# EAGLE design BMS MiniCAN Themistor Board Rev. 4 (EAGLE 7.7.0)
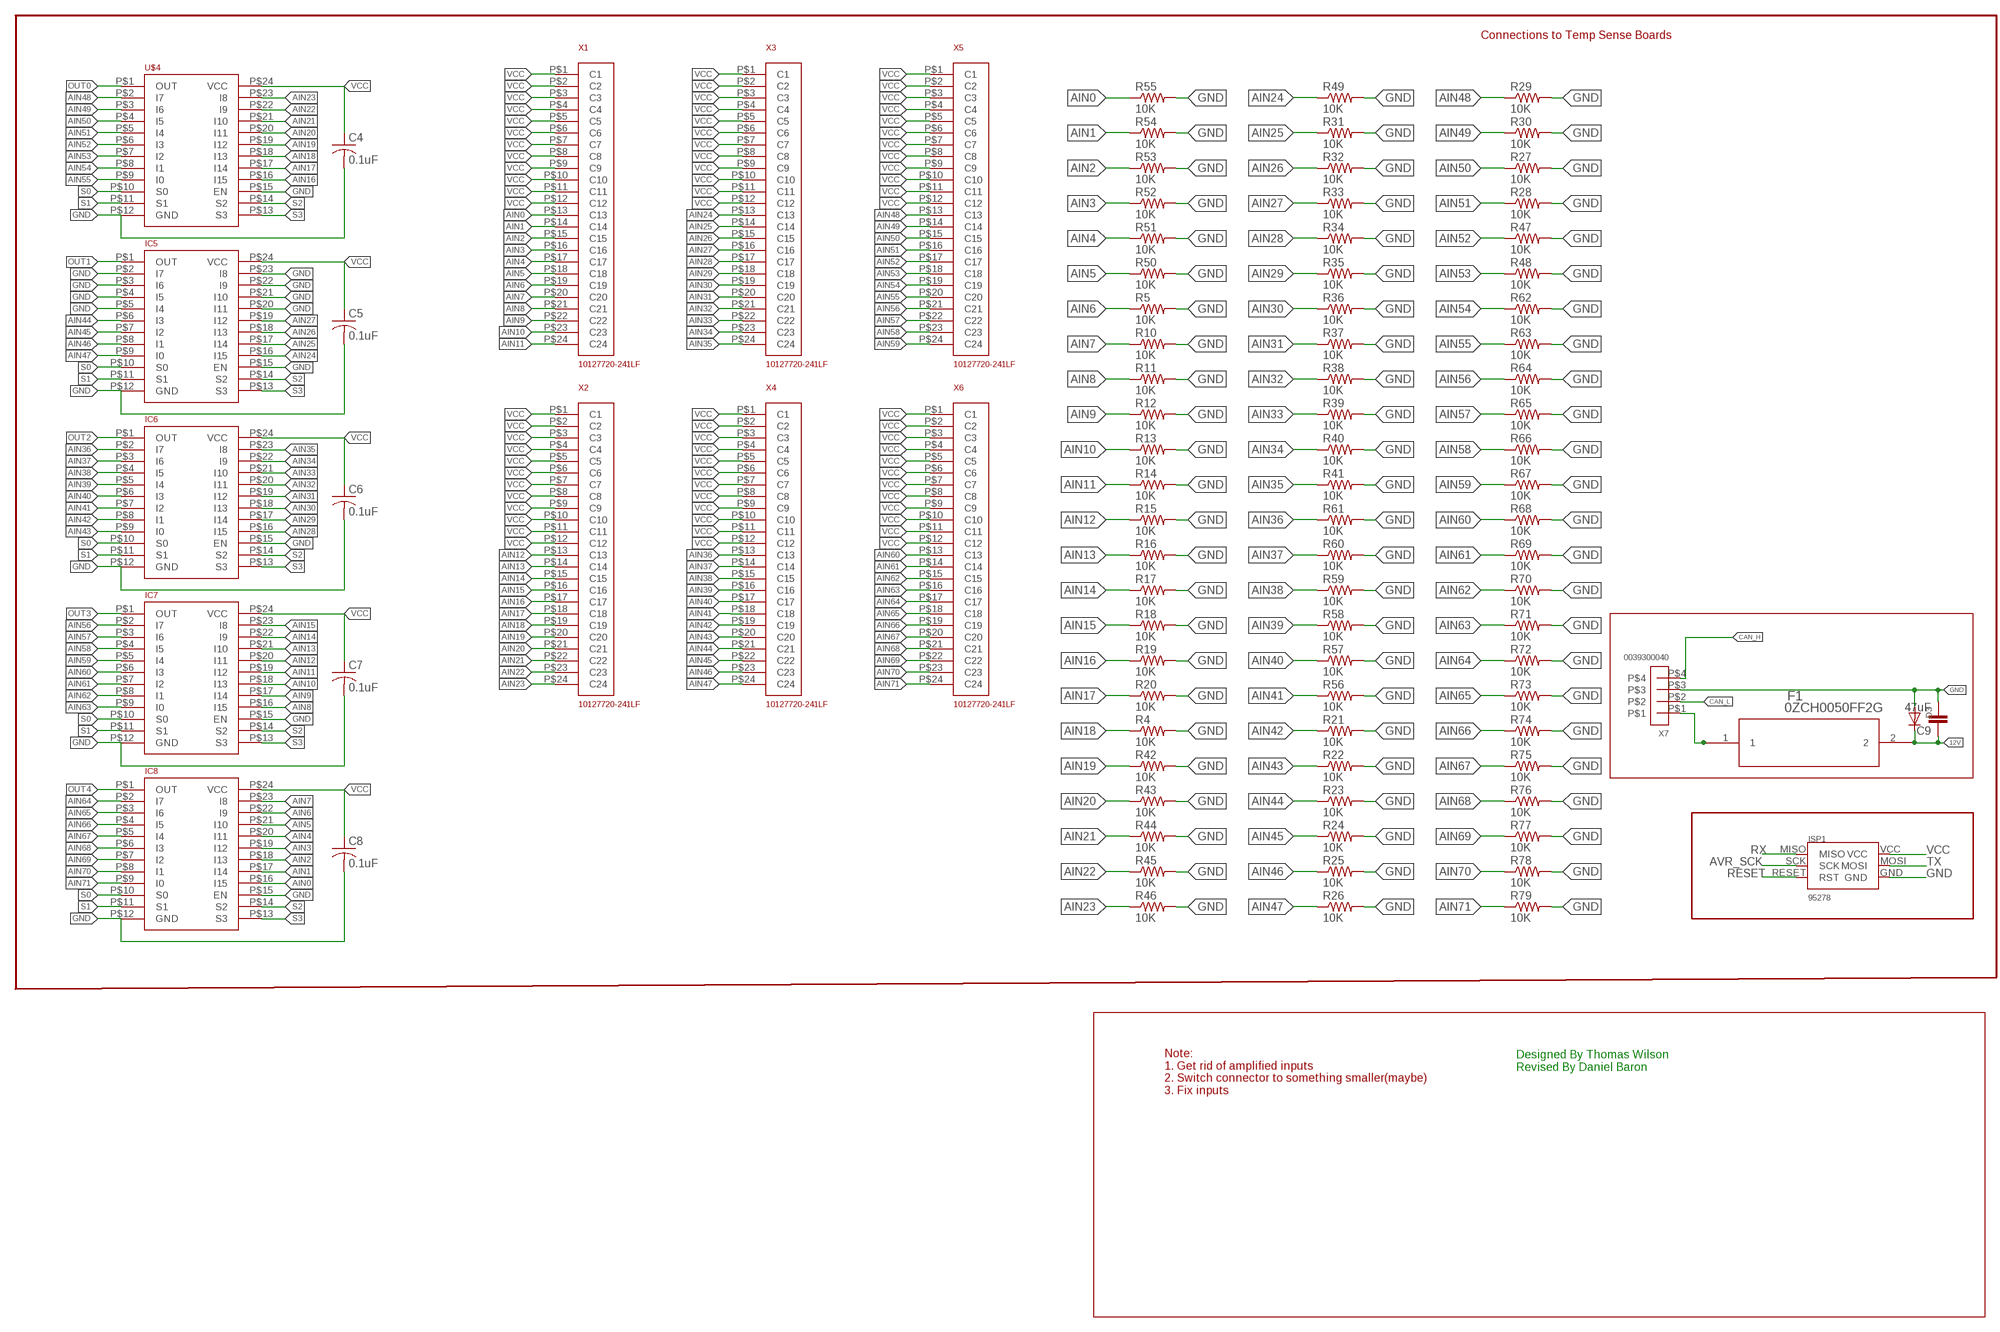
[diagram p0: schematic, sheet 1, part 1 of 2]
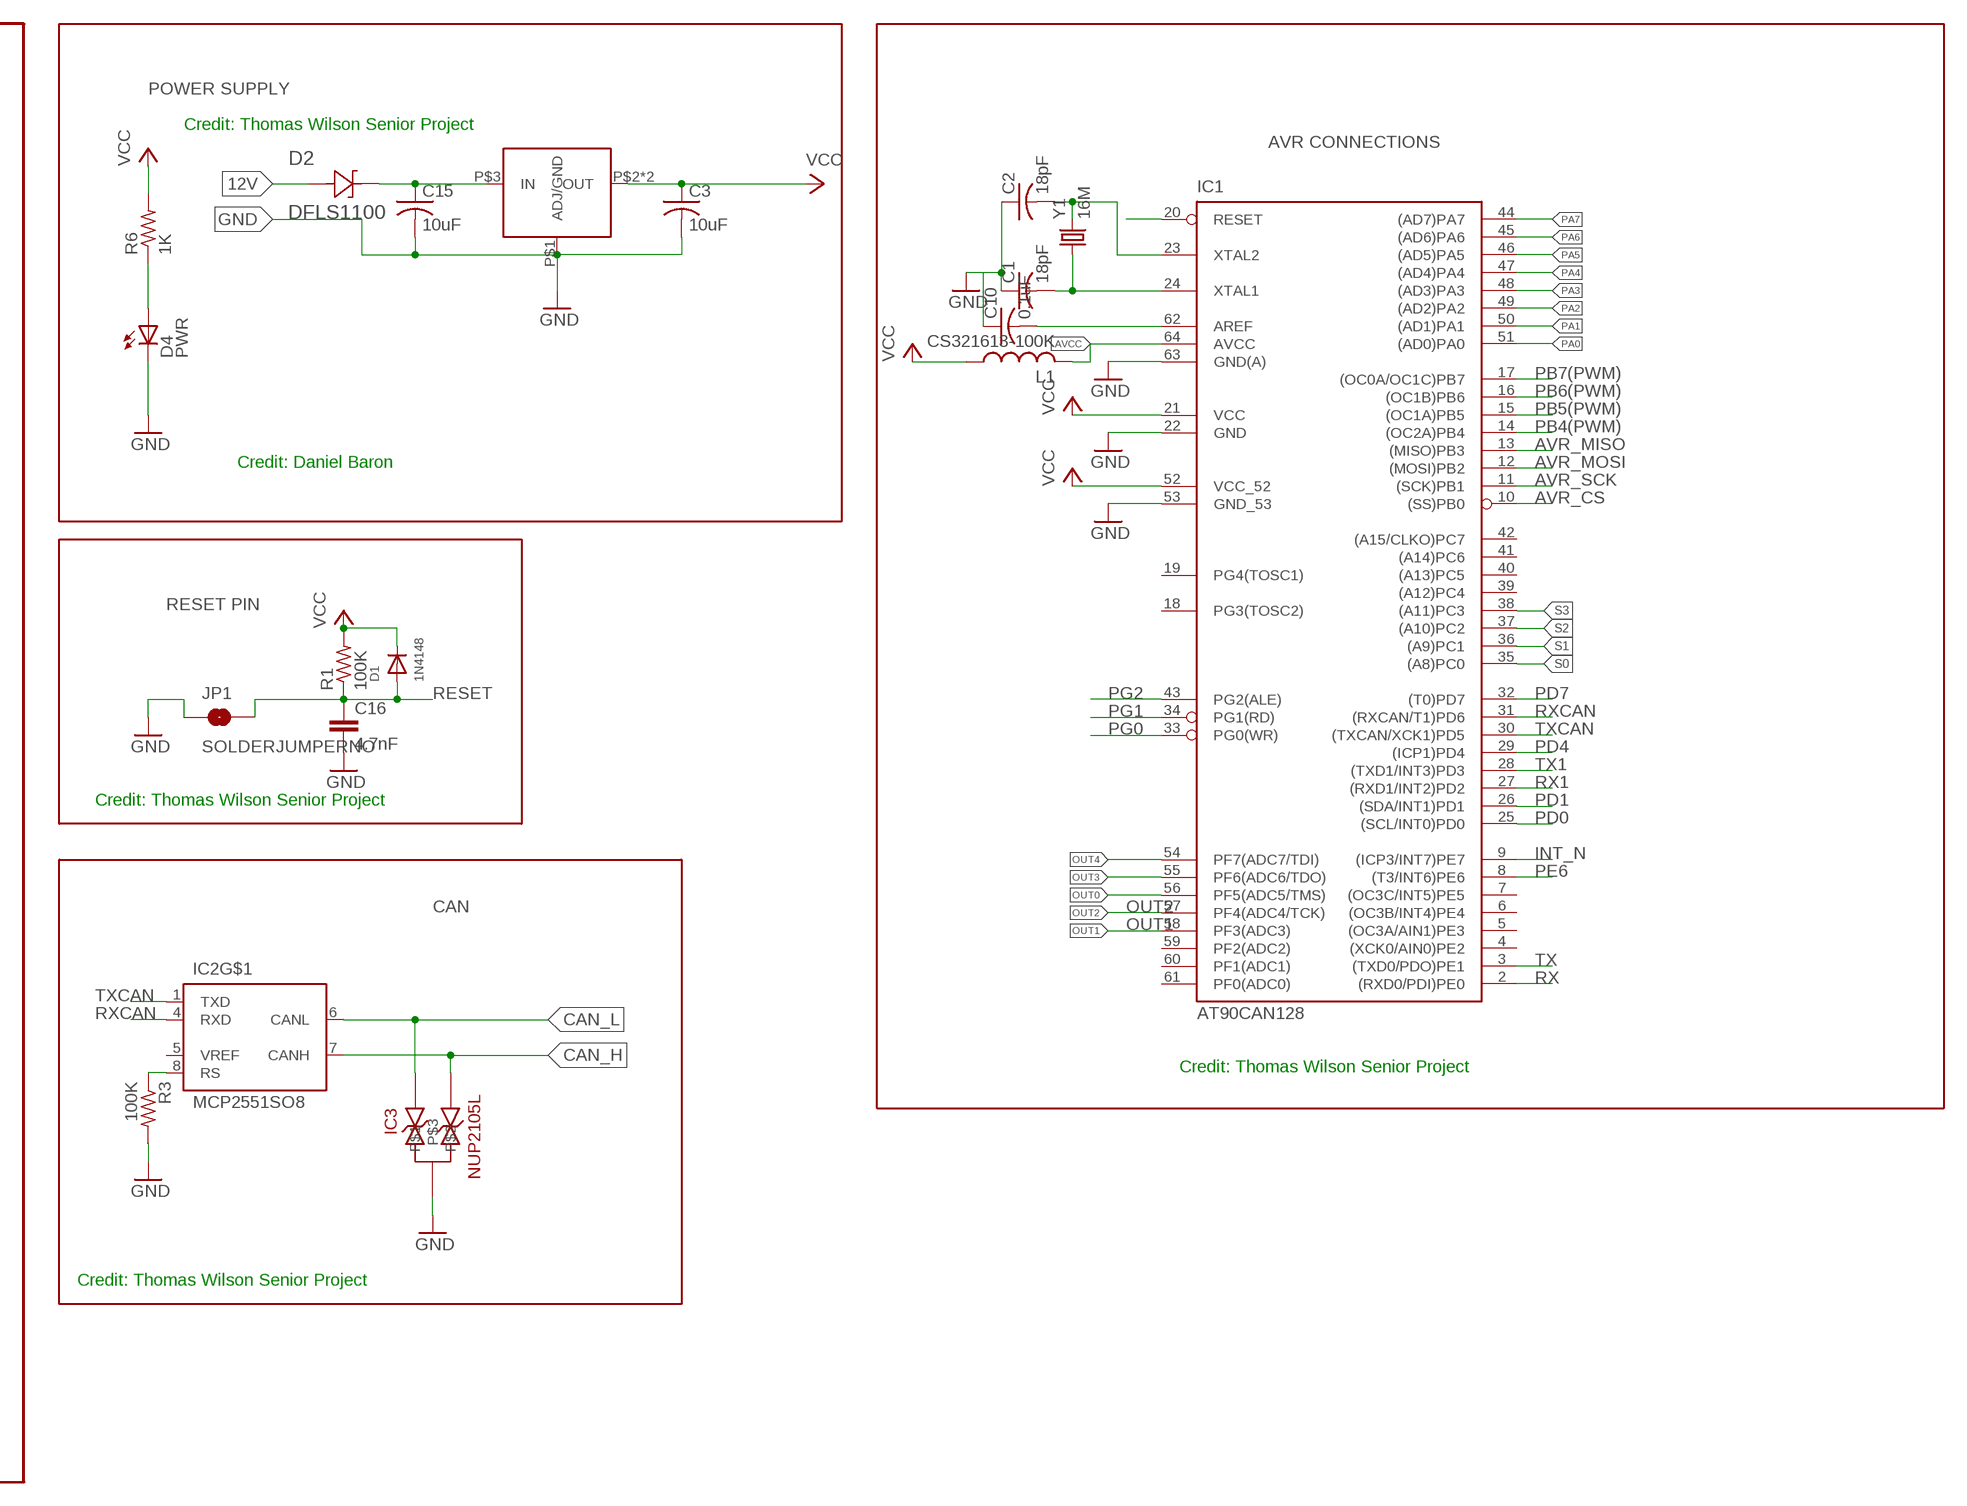
[diagram p1: schematic, sheet 1, part 2 of 2]

## Parts
C1  18pF  C-USC0805  [C0805]
C2  18pF  C-USC0805  [C0805]
C3  10uF  C-USC0805  [C0805]
C4  0.1uF  C-USC0805  [C0805]
C5  0.1uF  C-USC0805  [C0805]
C6  0.1uF  C-USC0805  [C0805]
C7  0.1uF  C-USC0805  [C0805]
C8  0.1uF  C-USC0805  [C0805]
C9  47uF  C-EUC0805  [C0805]
C10  0.1uF  C-USC0805  [C0805]
C15  10uF  C-USC0805  [C0805]
C16  4.7nF  CAP0603-CAP  [0603-CAP]
D1  1N4148  DIODESOD-123  [SOD-123]
D2  DFLS1100  [POWERDI-123]
D3  DIODESOD-323F  [SOD-323F]
D4  PWR  LEDCHIPLED_0805  [CHIPLED_0805]
F1  0ZCH0050FF2G  [0ZCH]
IC1  AT90CAN128  [TQFP64]
IC2  MCP2551SO8  [SO08]
IC3  NUP2105L  [SOT-23]
IC4  LM117MPX-5.0  [SOT223-4]
IC5  CD74HC4067  [24-SOIC]
IC6  CD74HC4067  [24-SOIC]
IC7  CD74HC4067  [24-SOIC]
IC8  CD74HC4067  [24-SOIC]
ISP1  95278  [6_PIN_.1PITCH]
JP1  SOLDERJUMPERNO  [SJ_2S-NO]
L1  CS321613-100K  L-USL3216C  [L3216C]
R1  100K  R-US_R0805  [R0805]
R3  100K  R-US_R0805  [R0805]
R4  10K  R-US_R0603  [R0603]
R5  10K  R-US_R0603  [R0603]
R6  1K  R-US_R0805  [R0805]
R10  10K  R-US_R0603  [R0603]
R11  10K  R-US_R0603  [R0603]
R12  10K  R-US_R0603  [R0603]
R13  10K  R-US_R0603  [R0603]
R14  10K  R-US_R0603  [R0603]
R15  10K  R-US_R0603  [R0603]
R16  10K  R-US_R0603  [R0603]
R17  10K  R-US_R0603  [R0603]
R18  10K  R-US_R0603  [R0603]
R19  10K  R-US_R0603  [R0603]
R20  10K  R-US_R0603  [R0603]
R21  10K  R-US_R0603  [R0603]
R22  10K  R-US_R0603  [R0603]
R23  10K  R-US_R0603  [R0603]
R24  10K  R-US_R0603  [R0603]
R25  10K  R-US_R0603  [R0603]
R26  10K  R-US_R0603  [R0603]
R27  10K  R-US_R0603  [R0603]
R28  10K  R-US_R0603  [R0603]
R29  10K  R-US_R0603  [R0603]
R30  10K  R-US_R0603  [R0603]
R31  10K  R-US_R0603  [R0603]
R32  10K  R-US_R0603  [R0603]
R33  10K  R-US_R0603  [R0603]
R34  10K  R-US_R0603  [R0603]
R35  10K  R-US_R0603  [R0603]
R36  10K  R-US_R0603  [R0603]
R37  10K  R-US_R0603  [R0603]
R38  10K  R-US_R0603  [R0603]
R39  10K  R-US_R0603  [R0603]
R40  10K  R-US_R0603  [R0603]
R41  10K  R-US_R0603  [R0603]
R42  10K  R-US_R0603  [R0603]
R43  10K  R-US_R0603  [R0603]
R44  10K  R-US_R0603  [R0603]
R45  10K  R-US_R0603  [R0603]
R46  10K  R-US_R0603  [R0603]
R47  10K  R-US_R0603  [R0603]
R48  10K  R-US_R0603  [R0603]
R49  10K  R-US_R0603  [R0603]
R50  10K  R-US_R0603  [R0603]
R51  10K  R-US_R0603  [R0603]
R52  10K  R-US_R0603  [R0603]
R53  10K  R-US_R0603  [R0603]
R54  10K  R-US_R0603  [R0603]
R55  10K  R-US_R0603  [R0603]
R56  10K  R-US_R0603  [R0603]
R57  10K  R-US_R0603  [R0603]
R58  10K  R-US_R0603  [R0603]
R59  10K  R-US_R0603  [R0603]
R60  10K  R-US_R0603  [R0603]
R61  10K  R-US_R0603  [R0603]
R62  10K  R-US_R0603  [R0603]
R63  10K  R-US_R0603  [R0603]
R64  10K  R-US_R0603  [R0603]
R65  10K  R-US_R0603  [R0603]
R66  10K  R-US_R0603  [R0603]
R67  10K  R-US_R0603  [R0603]
R68  10K  R-US_R0603  [R0603]
R69  10K  R-US_R0603  [R0603]
R70  10K  R-US_R0603  [R0603]
R71  10K  R-US_R0603  [R0603]
R72  10K  R-US_R0603  [R0603]
R73  10K  R-US_R0603  [R0603]
R74  10K  R-US_R0603  [R0603]
R75  10K  R-US_R0603  [R0603]
R76  10K  R-US_R0603  [R0603]
R77  10K  R-US_R0603  [R0603]
R78  10K  R-US_R0603  [R0603]
R79  10K  R-US_R0603  [R0603]
U$4  CD74HC4067  [24-SOIC]
X1  10127720-241LF  [10127720-241LF]
X2  10127720-241LF  [10127720-241LF]
X3  10127720-241LF  [10127720-241LF]
X4  10127720-241LF  [10127720-241LF]
X5  10127720-241LF  [10127720-241LF]
X6  10127720-241LF  [10127720-241LF]
X7  0039300040  [4_PIN_MOLEX]
Y1  16M  CRYSTALSMD  [HC49UP]

## Nets
12V: C9.1 D2.P$2 D3.C F1.2
12VIN: C15.1 D2.P$1 IC4.P$3(IN)
AIN0: IC8.P$16(I15) R55.1 X1.P$13(C13)
AIN1: IC8.P$17(I14) R54.1 X1.P$14(C14)
AIN2: IC8.P$18(I13) R53.1 X1.P$15(C15)
AIN3: IC8.P$19(I12) R52.1 X1.P$16(C16)
AIN4: IC8.P$20(I11) R51.1 X1.P$17(C17)
AIN5: IC8.P$21(I10) R50.1 X1.P$18(C18)
AIN6: IC8.P$22(I9) R5.1 X1.P$19(C19)
AIN7: IC8.P$23(I8) R10.1 X1.P$20(C20)
AIN8: IC7.P$16(I15) R11.1 X1.P$21(C21)
AIN9: IC7.P$17(I14) R12.1 X1.P$22(C22)
AIN10: IC7.P$18(I13) R13.1 X1.P$23(C23)
AIN11: IC7.P$19(I12) R14.1 X1.P$24(C24)
AIN12: IC7.P$20(I11) R15.1 X2.P$13(C13)
AIN13: IC7.P$21(I10) R16.1 X2.P$14(C14)
AIN14: IC7.P$22(I9) R17.1 X2.P$15(C15)
AIN15: IC7.P$23(I8) R18.1 X2.P$16(C16)
AIN16: R19.1 U$4.P$16(I15) X2.P$17(C17)
AIN17: R20.1 U$4.P$17(I14) X2.P$18(C18)
AIN18: R4.1 U$4.P$18(I13) X2.P$19(C19)
AIN19: R42.1 U$4.P$19(I12) X2.P$20(C20)
AIN20: R43.1 U$4.P$20(I11) X2.P$21(C21)
AIN21: R44.1 U$4.P$21(I10) X2.P$22(C22)
AIN22: R45.1 U$4.P$22(I9) X2.P$23(C23)
AIN23: R46.1 U$4.P$23(I8) X2.P$24(C24)
AIN24: IC5.P$16(I15) R49.1 X3.P$13(C13)
AIN25: IC5.P$17(I14) R31.1 X3.P$14(C14)
AIN26: IC5.P$18(I13) R32.1 X3.P$15(C15)
AIN27: IC5.P$19(I12) R33.1 X3.P$16(C16)
AIN28: IC6.P$16(I15) R34.1 X3.P$17(C17)
AIN29: IC6.P$17(I14) R35.1 X3.P$18(C18)
AIN30: IC6.P$18(I13) R36.1 X3.P$19(C19)
AIN31: IC6.P$19(I12) R37.1 X3.P$20(C20)
AIN32: IC6.P$20(I11) R38.1 X3.P$21(C21)
AIN33: IC6.P$21(I10) R39.1 X3.P$22(C22)
AIN34: IC6.P$22(I9) R40.1 X3.P$23(C23)
AIN35: IC6.P$23(I8) R41.1 X3.P$24(C24)
AIN36: IC6.P$2(I7) R61.1 X4.P$13(C13)
AIN37: IC6.P$3(I6) R60.1 X4.P$14(C14)
AIN38: IC6.P$4(I5) R59.1 X4.P$15(C15)
AIN39: IC6.P$5(I4) R58.1 X4.P$16(C16)
AIN40: IC6.P$6(I3) R57.1 X4.P$17(C17)
AIN41: IC6.P$7(I2) R56.1 X4.P$18(C18)
AIN42: IC6.P$8(I1) R21.1 X4.P$19(C19)
AIN43: IC6.P$9(I0) R22.1 X4.P$20(C20)
AIN44: IC5.P$6(I3) R23.1 X4.P$21(C21)
AIN45: IC5.P$7(I2) R24.1 X4.P$22(C22)
AIN46: IC5.P$8(I1) R25.1 X4.P$23(C23)
AIN47: IC5.P$9(I0) R26.1 X4.P$24(C24)
AIN48: R29.1 U$4.P$2(I7) X5.P$13(C13)
AIN49: R30.1 U$4.P$3(I6) X5.P$14(C14)
AIN50: R27.1 U$4.P$4(I5) X5.P$15(C15)
AIN51: R28.1 U$4.P$5(I4) X5.P$16(C16)
AIN52: R47.1 U$4.P$6(I3) X5.P$17(C17)
AIN53: R48.1 U$4.P$7(I2) X5.P$18(C18)
AIN54: R62.1 U$4.P$8(I1) X5.P$19(C19)
AIN55: R63.1 U$4.P$9(I0) X5.P$20(C20)
AIN56: IC7.P$2(I7) R64.1 X5.P$21(C21)
AIN57: IC7.P$3(I6) R65.1 X5.P$22(C22)
AIN58: IC7.P$4(I5) R66.1 X5.P$23(C23)
AIN59: IC7.P$5(I4) R67.1 X5.P$24(C24)
AIN60: IC7.P$6(I3) R68.1 X6.P$13(C13)
AIN61: IC7.P$7(I2) R69.1 X6.P$14(C14)
AIN62: IC7.P$8(I1) R70.1 X6.P$15(C15)
AIN63: IC7.P$9(I0) R71.1 X6.P$16(C16)
AIN64: IC8.P$2(I7) R72.1 X6.P$17(C17)
AIN65: IC8.P$3(I6) R73.1 X6.P$18(C18)
AIN66: IC8.P$4(I5) R74.1 X6.P$19(C19)
AIN67: IC8.P$5(I4) R75.1 X6.P$20(C20)
AIN68: IC8.P$6(I3) R76.1 X6.P$21(C21)
AIN69: IC8.P$7(I2) R77.1 X6.P$22(C22)
AIN70: IC8.P$8(I1) R78.1 X6.P$23(C23)
AIN71: IC8.P$9(I0) R79.1 X6.P$24(C24)
AREF: C10.2 IC1.62(AREF)
AVCC: IC1.64(AVCC) L1.2
AVR_CS: IC1.10((SS)PB0)
AVR_MISO: IC1.13((MISO)PB3)
AVR_MOSI: IC1.12((MOSI)PB2)
AVR_SCK: IC1.11((SCK)PB1) ISP1.SCK
CAN_H: IC2.7(CANH) IC3.2 X7.P$4
CAN_L: IC2.6(CANL) IC3.1 X7.P$2
GND: C1.1 C2.1 C3.2 C4.2 C5.2 C6.2 C7.2 C8.2 C9.2 C10.1 C15.2 C16.2 D3.A D4.C IC1.22(GND) IC1.53(GND_53) IC1.63(GND(A)) IC3.3 IC4.P$1(ADJ/GND) IC5.P$2(I7) IC5.P$3(I6) IC5.P$4(I5) IC5.P$5(I4) IC5.P$12(GND) IC5.P$15(EN) IC5.P$20(I11) IC5.P$21(I10) IC5.P$22(I9) IC5.P$23(I8) IC6.P$12(GND) IC6.P$15(EN) IC7.P$12(GND) IC7.P$15(EN) IC8.P$12(GND) IC8.P$15(EN) ISP1.GND JP1.1 R3.2 R4.2 R5.2 R10.2 R11.2 R12.2 R13.2 R14.2 R15.2 R16.2 R17.2 R18.2 R19.2 R20.2 R21.2 R22.2 R23.2 R24.2 R25.2 R26.2 R27.2 R28.2 R29.2 R30.2 R31.2 R32.2 R33.2 R34.2 R35.2 R36.2 R37.2 R38.2 R39.2 R40.2 R41.2 R42.2 R43.2 R44.2 R45.2 R46.2 R47.2 R48.2 R49.2 R50.2 R51.2 R52.2 R53.2 R54.2 R55.2 R56.2 R57.2 R58.2 R59.2 R60.2 R61.2 R62.2 R63.2 R64.2 R65.2 R66.2 R67.2 R68.2 R69.2 R70.2 R71.2 R72.2 R73.2 R74.2 R75.2 R76.2 R77.2 R78.2 R79.2 U$4.P$12(GND) U$4.P$15(EN) X7.P$3
INT_N: IC1.9((ICP3/INT7)PE7)
N$6: IC2.8(RS) R3.1
N$9: D4.A R6.1
OUT0: IC1.56(PF5(ADC5/TMS)) U$4.P$1(OUT)
OUT1: IC1.58(PF3(ADC3)) IC5.P$1(OUT)
OUT2: IC1.57(PF4(ADC4/TCK)) IC6.P$1(OUT)
OUT3: IC1.55(PF6(ADC6/TDO)) IC7.P$1(OUT)
OUT4: IC1.54(PF7(ADC7/TDI)) IC8.P$1(OUT)
PA0: IC1.51((AD0)PA0)
PA1: IC1.50((AD1)PA1)
PA2: IC1.49((AD2)PA2)
PA3: IC1.48((AD3)PA3)
PA4: IC1.47((AD4)PA4)
PA5: IC1.46((AD5)PA5)
PA6: IC1.45((AD6)PA6)
PA7: IC1.44((AD7)PA7)
PB4(PWM): IC1.14((OC2A)PB4)
PB5(PWM): IC1.15((OC1A)PB5)
PB6(PWM): IC1.16((OC1B)PB6)
PB7(PWM): IC1.17((OC0A/OC1C)PB7)
PD0: IC1.25((SCL/INT0)PD0)
PD1: IC1.26((SDA/INT1)PD1)
PD4: IC1.29((ICP1)PD4)
PD7: IC1.32((T0)PD7)
PE6: IC1.8((T3/INT6)PE6)
PG0: IC1.33(PG0(WR))
PG1: IC1.34(PG1(RD))
PG2: IC1.43(PG2(ALE))
RESET: C16.1 D1.A IC1.20(RESET) ISP1.RESET(RST) JP1.2 R1.1
RX: IC1.2((RXD0/PDI)PE0) ISP1.MISO
RX1: IC1.27((RXD1/INT2)PD2)
RXCAN: IC1.31((RXCAN/T1)PD6) IC2.4(RXD)
S0: IC1.35((A8)PC0) IC5.P$10(S0) IC6.P$10(S0) IC7.P$10(S0) IC8.P$10(S0) U$4.P$10(S0)
S1: IC1.36((A9)PC1) IC5.P$11(S1) IC6.P$11(S1) IC7.P$11(S1) IC8.P$11(S1) U$4.P$11(S1)
S2: IC1.37((A10)PC2) IC5.P$14(S2) IC6.P$14(S2) IC7.P$14(S2) IC8.P$14(S2) U$4.P$14(S2)
S3: IC1.38((A11)PC3) IC5.P$13(S3) IC6.P$13(S3) IC7.P$13(S3) IC8.P$13(S3) U$4.P$13(S3)
TX: IC1.3((TXD0/PDO)PE1) ISP1.MOSI
TX1: IC1.28((TXD1/INT3)PD3)
TXCAN: IC1.30((TXCAN/XCK1)PD5) IC2.1(TXD)
UF_12V: F1.1 X7.P$1
VCC: C3.1 C4.1 C5.1 C6.1 C7.1 C8.1 D1.C IC1.21(VCC) IC1.52(VCC_52) IC4.P$2(OUT) IC4.P$4(OUT) IC5.P$24(VCC) IC6.P$24(VCC) IC7.P$24(VCC) IC8.P$24(VCC) ISP1.VCC L1.1 R1.2 R6.2 U$4.P$24(VCC) X1.P$1(C1) X1.P$2(C2) X1.P$3(C3) X1.P$4(C4) X1.P$5(C5) X1.P$6(C6) X1.P$7(C7) X1.P$8(C8) X1.P$9(C9) X1.P$10(C10) X1.P$11(C11) X1.P$12(C12) X2.P$1(C1) X2.P$2(C2) X2.P$3(C3) X2.P$4(C4) X2.P$5(C5) X2.P$6(C6) X2.P$7(C7) X2.P$8(C8) X2.P$9(C9) X2.P$10(C10) X2.P$11(C11) X2.P$12(C12) X3.P$1(C1) X3.P$2(C2) X3.P$3(C3) X3.P$4(C4) X3.P$5(C5) X3.P$6(C6) X3.P$7(C7) X3.P$8(C8) X3.P$9(C9) X3.P$10(C10) X3.P$11(C11) X3.P$12(C12) X4.P$1(C1) X4.P$2(C2) X4.P$3(C3) X4.P$4(C4) X4.P$5(C5) X4.P$6(C6) X4.P$7(C7) X4.P$8(C8) X4.P$9(C9) X4.P$10(C10) X4.P$11(C11) X4.P$12(C12) X5.P$1(C1) X5.P$2(C2) X5.P$3(C3) X5.P$4(C4) X5.P$5(C5) X5.P$6(C6) X5.P$7(C7) X5.P$8(C8) X5.P$9(C9) X5.P$10(C10) X5.P$11(C11) X5.P$12(C12) X6.P$1(C1) X6.P$2(C2) X6.P$3(C3) X6.P$4(C4) X6.P$5(C5) X6.P$6(C6) X6.P$7(C7) X6.P$8(C8) X6.P$9(C9) X6.P$10(C10) X6.P$11(C11) X6.P$12(C12)
XTAL1: C1.2 IC1.24(XTAL1) Y1.1
XTAL2: C2.2 IC1.23(XTAL2) Y1.2
Unconnected: IC1.4((XCK0/AIN0)PE2) IC1.5((OC3A/AIN1)PE3) IC1.6((OC3B/INT4)PE4) IC1.7((OC3C/INT5)PE5) IC1.18(PG3(TOSC2)) IC1.19(PG4(TOSC1)) IC1.39((A12)PC4) IC1.40((A13)PC5) IC1.41((A14)PC6) IC1.42((A15/CLKO)PC7) IC1.59(PF2(ADC2)) IC1.60(PF1(ADC1)) IC1.61(PF0(ADC0)) IC2.5(VREF)

## Notes on the sheet
- Connections to Temp Sense Boards
- POWER SUPPLY
- Credit: Thomas Wilson Senior Project
- AVR CONNECTIONS
- Credit: Daniel Baron
- RESET PIN
- Credit: Thomas Wilson Senior Project
- CAN
- Credit: Thomas Wilson Senior Project
- Credit: Thomas Wilson Senior Project
- Designed By Thomas Wilson
  Revised By Daniel Baron
- Note:
  1. Get rid of amplified inputs
  2. Switch connector to something smaller(maybe)
  3. Fix inputs

## Power pins joined to a net without a drawn wire
GND: IC2.2(GND)
VCC: IC2.3(VCC)

## Library data of the parts
C1 C2 C4-C8 C10 = rcl:C-US: CAPACITOR, American symbol
C3 C15 = resistor:C-US: CAPACITOR, American symbol
C9 = rcl:C-EU: CAPACITOR, European symbol
C16 = SparkFun-Capacitors:CAP: Capacitor Standard 0603 ceramic capacitor, and 0.1" leaded capacitor.
D1 D3 = adafruit:DIODE: Diode SMADIODE - SMA Surface Mount Package 20V 1A Schottky Diode Digikey: 641-1014-6-ND DO-1N4148 - Through Hole Small Current Diode SOD-123 20V 1 A (.5mV Vf) Schottky Diode - Digikey: MBRX120TPMSCT-ND SOD-323 10V 570mA (.38mV Vf, 3ns) Schottky Diode - Digikey: ZLLS410CT-ND SOD-523 30V 30mA Schottky Diode (RB751S-40TE61) - Digikey: RB751S-40TE61CT-ND SOT23-R/W - SOT23 Package (R = Solder Paste/Reflow Ovens, W = Hand-Soldering) BAT54Film 40V 300mA - Digikey: 497-7162-1-ND
D2 = BMS Lbr:DFLS1100: 1.0A HIGH VOLTAGE SCHOTTKY BARRIER RECTIFIER
D4 = led:LED: LED OSRAM: - CHIPLED LG R971, LG N971, LY N971, LG Q971, LY Q971, LO R971, LY R971 LH N974, LH R974 LS Q976, LO Q976, LY Q976 LO Q996 - Hyper CHIPLED LW Q18S LB Q993, LB Q99A, LB R99A - SideLED LS A670, LO A670, LY A670, LG A670, LP A670 LB A673, LV A673, LT A673, LW A673 LH A674 LY A675 LS A676, LA A676, LO A676, LY A676, LW A676 LS A679, LY A679, LG A679 - Hyper Micro SIDELED® LS Y876, LA Y876, LO Y876, LY Y876 LT Y87S - SmartLED LW L88C, LW L88S LB L89C, LB L89S, LG L890 LS L89K, LO L89K, LY L89K LS L896, LA L896, LO L896, LY L896 - TOPLED LS T670, LO T670, LY T670, LG T670, LP T670 LSG T670, LSP T670, LSY T670, LOP T670, LYG T670 LG T671, LOG T671, LSG T671 LB T673, LV T673, LT T673, LW T673 LH T674 LS T676, LA T676, LO T676, LY T676, LB T676, LH T676, LSB T676, LW T676 LB T67C, LV T67C, LT T67C, LS T67K, LO T67K, LY T67K, LW E67C LS E67B, LA E67B, LO E67B, LY E67B, LB E67C, LV E67C, LT E67C LW T67C LS T679, LY T679, LG T679 LS T770, LO T770, LY T770, LG T770, LP T770 LB T773, LV T773, LT T773, LW T773 LH T774 LS E675, LA E675, LY E675, LS T675 LS T776, LA T776, LO T776, LY T776, LB T776 LHGB T686 LT T68C, LB T68C - Hyper Mini TOPLED® LB M676 - Mini TOPLED Santana® LG M470 LS M47K, LO M47K, LY M47K Source: http://www.osram.convergy.de LUXEON: - LUMILED® LXK2-PW12-R00, LXK2-PW12-S00, LXK2-PW14-U00, LXK2-PW14-V00 LXK2-PM12-R00, LXK2-PM12-S00, LXK2-PM14-U00 LXK2-PE12-Q00, LXK2-PE12-R00, LXK2-PE12-S00, LXK2-PE14-T00, LXK2-PE14-U00 LXK2-PB12-K00, LXK2-PB12-L00, LXK2-PB12-M00, LXK2-PB14-N00, LXK2-PB14-P00, LXK2-PB14-Q00 LXK2-PR12-L00, LXK2-PR12-M00, LXK2-PR14-Q00, LXK2-PR14-R00 LXK2-PD12-Q00, LXK2-PD12-R00, LXK2-PD12-S00 LXK2-PH12-R00, LXK2-PH12-S00 LXK2-PL12-P00, LXK2-PL12-Q00, LXK2-PL12-R00 Source: www.luxeon.com KINGBRIGHT: KA-3528ASYC Source: www.kingbright.com
F1 = BMS Lbr:0ZCH0050FF2G; COPYRIGHT: Copyright (C) 2016 Accelerated Designs. All rights reserved; MANUFACTURER_PART_NUMBER: 0ZCH0050FF2G; VENDOR: Belfuse
IC1 = at90can128:AT90CAN128
IC2 = can:MCP2551: CAN Tranceiver Microchip
IC3 = Artificial Science:NUP2105L
IC4 = BMS Lbr:LM117MPX-5.0: 5V fixed voltage regulator, 1%
IC5-IC8 U$4 = BMS Lbr:CD74HC4067: High-Speed CMOS Logic 16-Channel Analog Multiplexer/Demultiplexer
ISP1 = con-amphenol:95278: SMD ISP Connector
JP1 = SparkFun-Passives:SOLDERJUMPER: Solder Jumper Standard SMD solder jumper. Used to automate production. Two varients : Normally Open and Normally Closed are the same, but have different paste layers. NC will have a large amount of paste and should jumper during reflow.
L1 = rcl:L-US: INDUCTOR, American symbol
R1 R3 R6 = rcl:R-US_: RESISTOR, American symbol
R4 R5 R10-R79 = adafruit:R-US_: RESISTOR, American symbol
X1-X6 = con-amphenol:10127720-241LF: 24 Positions Plug Connector 0.118" (3.00mm) Through Hole, Right Angle Tin
X7 = BMS Lbr:0039300040: 4 Positions Header, Shrouded Connector 0.165" (4.20mm) Through Hole, Right Angle Tin
Y1 = SparkFun-FreqCtrl:CRYSTAL: Various standard crystals. Proven footprints. Spark Fun Electronics SKU : COM-00534

## Board
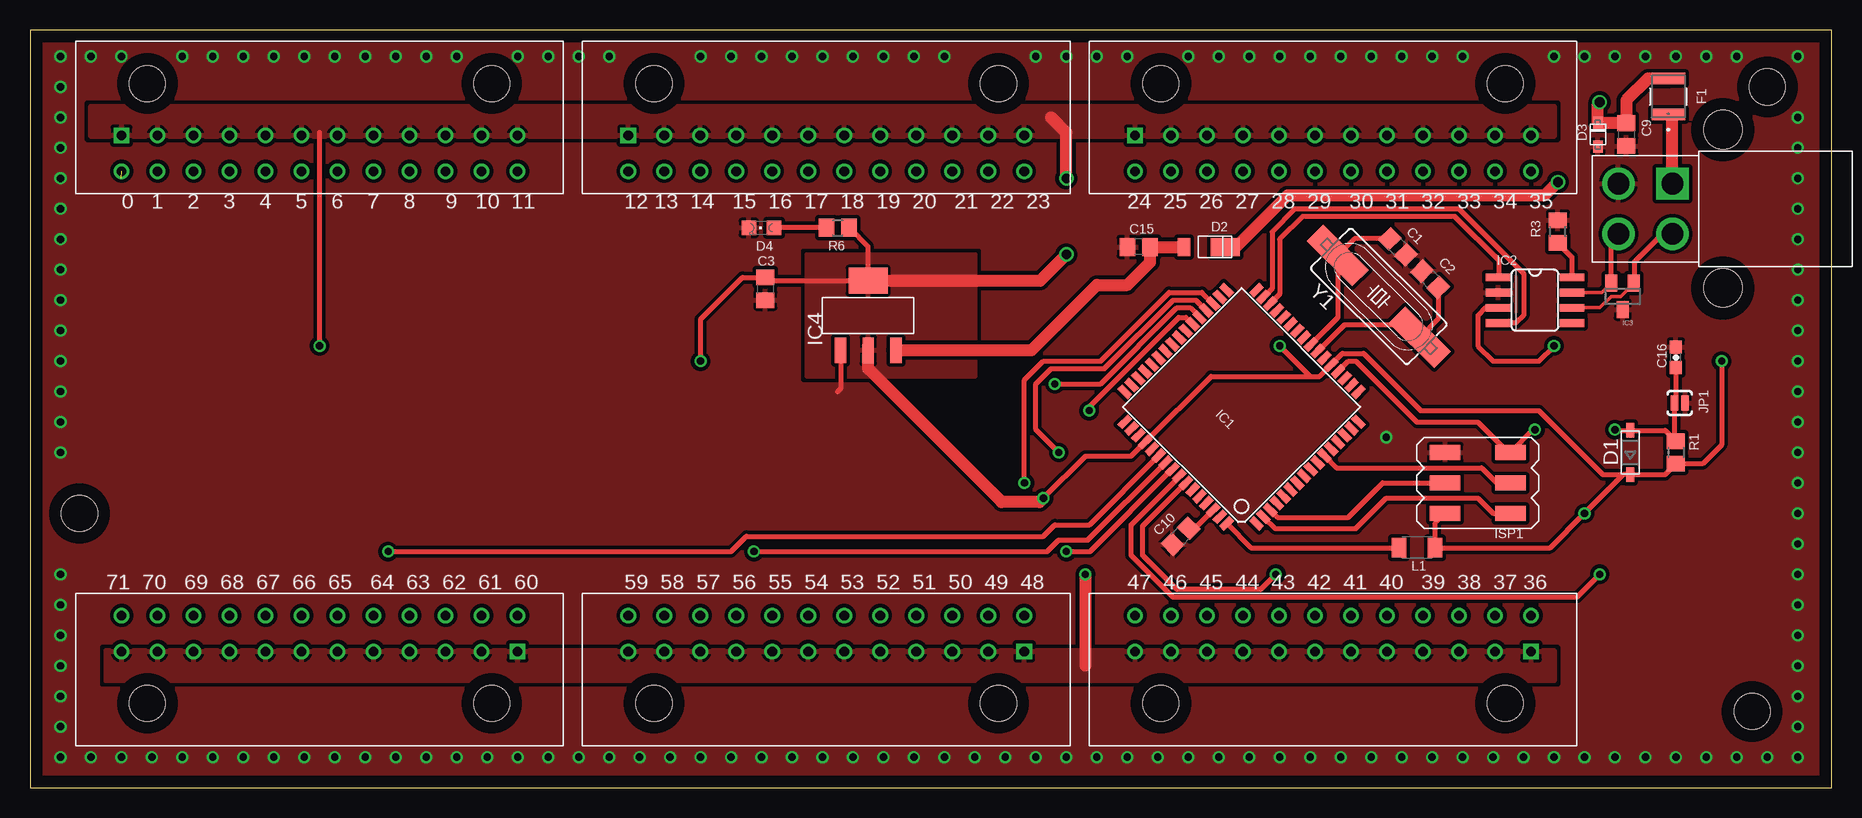
[diagram p2: board, top side]
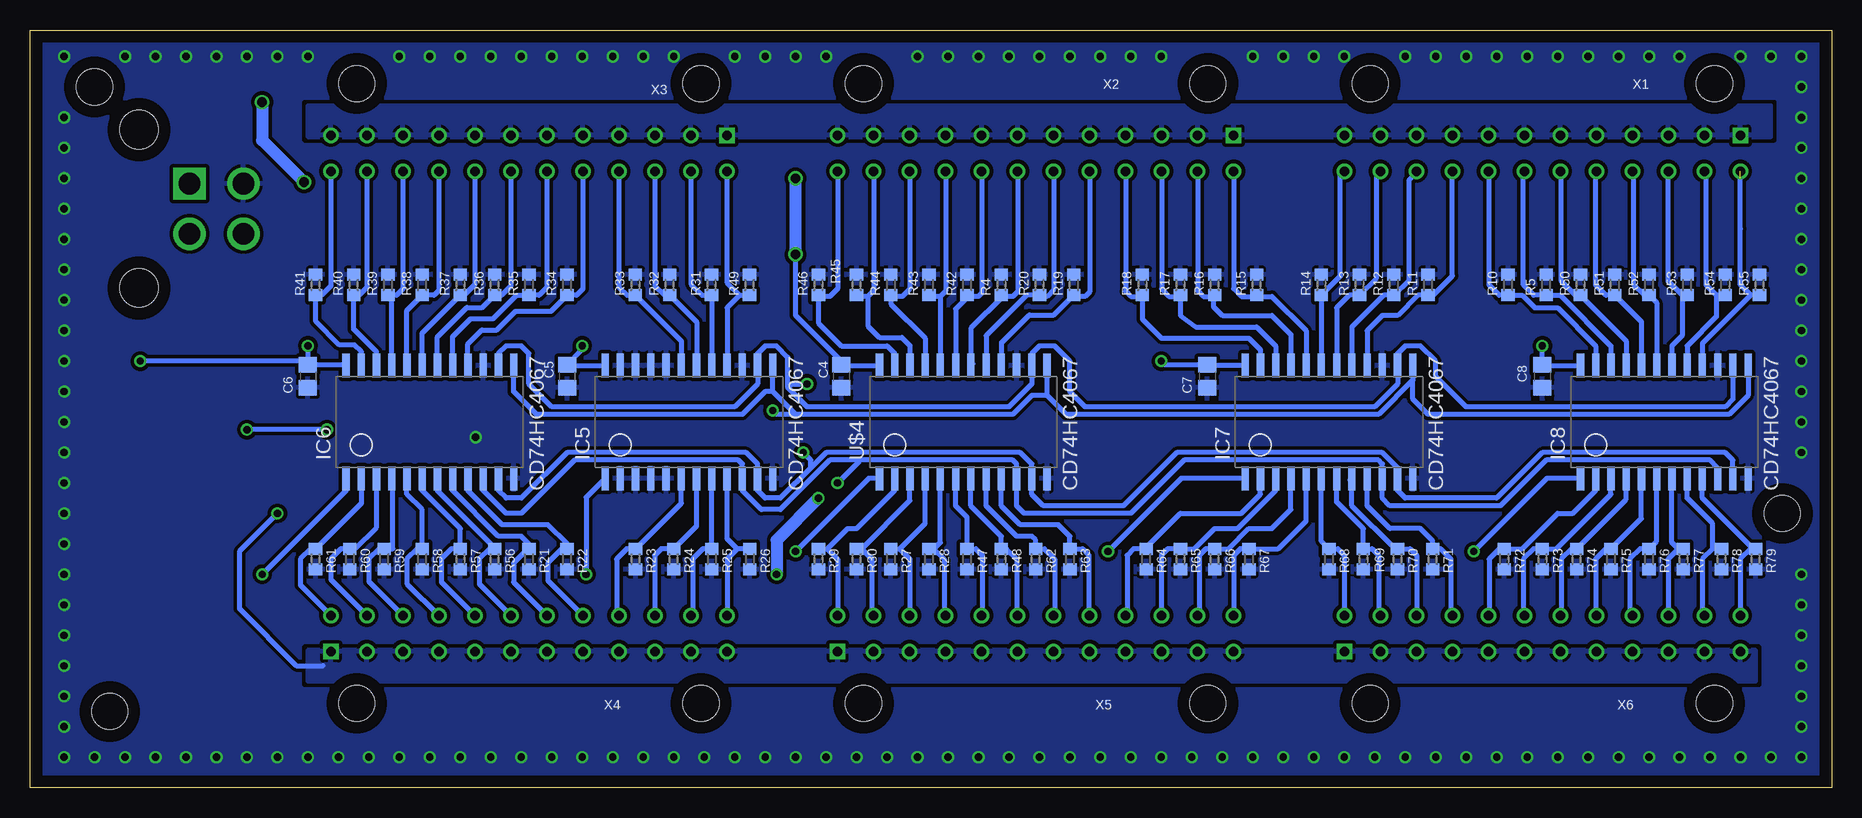
[diagram p3: board, bottom side, seen from below]

Size 150.16 x 63.17 mm. Coordinates in mm from the lower left corner, seen from the top.
Outline: 0,0 150.16,0 150.16,63.17 0,63.17 0,0
Copper layers (1*16): Top 0.035mm / dielectric 1.5mm / Bottom 0.035mm
Design rules "default": minimum track width 10mil, minimum drill 24mil, track to track 8mil, track to pad 8mil, pad to pad 8mil, via to via 8mil, smd to smd 8mil, copper to edge 40mil, drill to drill 8mil, minimum pad ring 10mil, minimum via ring 8mil, stop-mask expansion 4mil, vias tented up to drill 0mil, thermal gap 10mil
Holes 3 mm at 144.78,58.42 143.51,6.35 4.13,22.86

### Footprints (pad centres in the part's own frame; a part is rotated, then mirrored left to right if it is on the bottom)
C0805 = smd 1.3 x 1.5: 1 -0.95,0; 2 0.95,0
0603-CAP = smd 1.1 x 1: 1 -0.85,0; 2 0.85,0
SOD-123 = smd 1.2 x 0.7: A 1.85,0; C -1.85,0
POWERDI-123 = smd 1.05 x 1.5: P$1 -2.575,0 | smd 2.4 x 1.5: P$2 0.85,0
SOD-323F = smd 1 x 0.8: A -1,0; C 1,0
CHIPLED_0805 = smd 1.2 x 1.2: A 0,-1.05; C 0,1.05
0ZCH = smd 0.991 x 2.794: 1 -1.499,0; 2 1.499,0
TQFP64 = smd 1.194 x 0.559: 1 -7.76,6; 2 -7.76,5.2; 3 -7.76,4.4; 4 -7.76,3.6; 5 -7.76,2.8; 6 -7.76,2; 7 -7.76,1.2; 8 -7.76,0.4; 9 -7.76,-0.4; 10 -7.76,-1.2; 11 -7.76,-2; 12 -7.76,-2.8; 13 -7.76,-3.6; 14 -7.76,-4.4; 15 -7.76,-5.2; 16 -7.76,-6; 33 7.76,-6; 34 7.76,-5.2; 35 7.76,-4.4; 36 7.76,-3.6; 37 7.76,-2.8; 38 7.76,-2; 39 7.76,-1.2; 40 7.76,-0.4; 41 7.76,0.4; 42 7.76,1.2; 43 7.76,2; 44 7.76,2.8; 45 7.76,3.6; 46 7.76,4.4; 47 7.76,5.2; 48 7.76,6 | smd 0.559 x 1.194: 17 -6,-7.76; 18 -5.2,-7.76; 19 -4.4,-7.76; 20 -3.6,-7.76; 21 -2.8,-7.76; 22 -2,-7.76; 23 -1.2,-7.76; 24 -0.4,-7.76; 25 0.4,-7.76; 26 1.2,-7.76; 27 2,-7.76; 28 2.8,-7.76; 29 3.6,-7.76; 30 4.4,-7.76; 31 5.2,-7.76; 32 6,-7.76; 49 6,7.76; 50 5.2,7.76; 51 4.4,7.76; 52 3.6,7.76; 53 2.8,7.76; 54 2,7.76; 55 1.2,7.76; 56 0.4,7.76; 57 -0.4,7.76; 58 -1.2,7.76; 59 -2,7.76; 60 -2.8,7.76; 61 -3.6,7.76; 62 -4.4,7.76; 63 -5.2,7.76; 64 -6,7.76
SO08 = smd 0.66 x 2.032: 1 -1.905,-3.073; 2 -0.635,-3.073; 3 0.635,-3.073; 4 1.905,-3.073; 5 1.905,3.073; 6 0.635,3.073; 7 -0.635,3.073; 8 -1.905,3.073
SOT-23 = smd 1 x 1.4: 1 -0.95,-1.1; 2 0.95,-1.1; 3 0,1.1
SOT223-4 = smd 0.95 x 2.15: P$1 -2.3,-2.9; P$2 0,-2.9; P$3 2.3,-2.9 | smd 3.25 x 2.15: P$4 0,2.9
24-SOIC = smd 0.6 x 2: P$1 -6.985,-4.7; P$2 -5.715,-4.7; P$3 -4.445,-4.7; P$4 -3.175,-4.7; P$5 -1.905,-4.7; P$6 -0.635,-4.7; P$7 0.635,-4.7; P$8 1.905,-4.7; P$9 3.175,-4.7; P$10 4.445,-4.7; P$11 5.715,-4.7; P$12 6.985,-4.7; P$13 6.985,4.7; P$14 5.715,4.7; P$15 4.445,4.7; P$16 3.175,4.7; P$17 1.905,4.7; P$18 0.635,4.7; P$19 -0.635,4.7; P$20 -1.905,4.7; P$21 -3.175,4.7; P$22 -4.445,4.7; P$23 -5.715,4.7; P$24 -6.985,4.7
6_PIN_.1PITCH = smd 2.54 x 1.27: GND 2.73,-2.54; MISO -2.73,2.54; MOSI 2.73,0; RESET -2.73,-2.54; SCK -2.73,0; VCC 2.73,2.54
SJ_2S-NO = smd 0.635 x 1.27: 1 -0.45,0; 2 0.45,0
L3216C = smd 1.2 x 1.6: 1 -1.5,0; 2 1.5,0
R0805 = smd 1.3 x 1.5: 1 -0.95,0; 2 0.95,0
R0603 = smd 1 x 1.1: 1 -0.85,0; 2 0.85,0
10127720-241LF = drill 0.8 pad 1.02 square: P$1 16.5,1.5 | drill 0.8 pad 1.02: P$2 13.5,1.5; P$3 10.5,1.5; P$4 7.5,1.5; P$5 4.5,1.5; P$6 1.5,1.5; P$7 -1.5,1.5; P$8 -4.5,1.5; P$9 -7.5,1.5; P$10 -10.5,1.5; P$11 -13.5,1.5; P$12 -16.5,1.5; P$13 16.5,4.5; P$14 13.5,4.5; P$15 10.5,4.5; P$16 7.5,4.5; P$17 4.5,4.5; P$18 1.5,4.5; P$19 -1.5,4.5; P$20 -4.5,4.5; P$21 -7.5,4.5; P$22 -10.5,4.5; P$23 -13.5,4.5; P$24 -16.5,4.5 | hole 3: -14.35,-2.82; 14.35,-2.82
4_PIN_MOLEX = drill 1.8 square: P$1 2.1,-2.25 | drill 1.8: P$2 -2.1,-2.25; P$3 2.1,2.25; P$4 -2.1,2.25 | hole 3.2: 6.6,-6.45; -6.6,-6.45
HC49UP = smd 5.334 x 1.93: 1 -4.826,0; 2 4.826,0

### Placement (x,y rotation side)
C1  113.98,45.09 135 top
C2  116.68,42.39 315 top
C3  61.28,41.59 270 top
C4  82.55,34.29 270 bottom
C5  105.41,34.29 270 bottom
C6  127,34.29 270 bottom
C7  52.07,34.29 270 bottom
C8  24.13,34.29 270 bottom
C9  133.03,54.45 270 top
C10  95.89,20.95 45 top
C15  92.39,45.09 180 top
C16  137.16,35.88 90 top
D1  133.35,27.94 90 top
D2  98.74,45.09 0 top
D3  130.65,54.45 90 top
D4  60.96,46.67 90 top
F1  136.53,57.63 90 top
IC1  100.97,31.75 135 top
IC2  125.41,40.64 270 top
IC3  132.72,40.96 180 top
IC4  69.85,39.37 0 top
IC5  95.25,30.48 0 bottom
IC6  116.84,30.48 0 bottom
IC7  41.91,30.48 0 bottom
IC8  13.97,30.48 0 bottom
ISP1  120.65,25.4 180 top
JP1  137.48,32.07 180 top
L1  115.57,20 180 top
R1  137.16,27.94 270 top
R3  127.32,46.36 90 top
R4  69.22,41.91 90 bottom
R5  23.81,41.91 90 bottom
R6  67.31,46.67 0 top
R10  26.99,41.91 90 bottom
R11  33.66,41.91 90 bottom
R12  36.51,41.91 90 bottom
R13  39.37,41.91 90 bottom
R14  42.55,41.91 90 bottom
R15  47.94,41.91 90 bottom
R16  51.44,41.91 90 bottom
R17  54.29,41.91 90 bottom
R18  57.47,41.91 90 bottom
R19  63.18,41.91 90 bottom
R20  66.04,41.91 90 bottom
R21  108.58,19.05 270 bottom
R22  105.41,19.05 270 bottom
R23  99.69,19.05 270 bottom
R24  96.52,19.05 270 bottom
R25  93.34,19.05 270 bottom
R26  90.17,19.05 270 bottom
R27  78.42,19.05 270 bottom
R28  75.25,19.05 270 bottom
R29  84.45,19.05 270 bottom
R30  81.28,19.05 270 bottom
R31  93.38,41.91 90 bottom
R32  96.86,41.91 90 bottom
R33  99.72,41.91 90 bottom
R34  105.41,41.91 90 bottom
R35  108.58,41.91 90 bottom
R36  111.44,41.91 90 bottom
R37  114.3,41.91 90 bottom
R38  117.47,41.91 90 bottom
R39  120.33,41.91 90 bottom
R40  123.19,41.91 90 bottom
R41  126.36,41.91 90 bottom
R42  72.07,41.91 90 bottom
R43  75.25,41.91 90 bottom
R44  78.42,41.91 90 bottom
R45  81.28,41.91 90 bottom
R46  84.45,41.91 90 bottom
R47  72.07,19.05 270 bottom
R48  69.22,19.05 270 bottom
R49  90.2,41.91 90 bottom
R50  20.95,41.91 90 bottom
R51  18.1,41.91 90 bottom
R52  15.24,41.91 90 bottom
R53  12.06,41.91 90 bottom
R54  8.89,41.91 90 bottom
R55  6.03,41.91 90 bottom
R56  111.44,19.05 270 bottom
R57  114.3,19.05 270 bottom
R58  117.47,19.05 270 bottom
R59  120.65,19.05 270 bottom
R60  123.51,19.05 270 bottom
R61  126.36,19.05 270 bottom
R62  66.36,19.05 270 bottom
R63  63.5,19.05 270 bottom
R64  57.15,19.05 270 bottom
R65  54.29,19.05 270 bottom
R66  51.44,19.05 270 bottom
R67  48.58,19.05 270 bottom
R68  41.91,19.05 270 bottom
R69  39.05,19.05 270 bottom
R70  36.2,19.05 270 bottom
R71  33.27,19.05 270 bottom
R72  27.3,19.05 270 bottom
R73  24.13,19.05 270 bottom
R74  21.27,19.05 270 bottom
R75  18.41,19.05 270 bottom
R76  15.24,19.05 270 bottom
R77  12.38,19.05 270 bottom
R78  9.21,19.05 270 bottom
R79  6.35,19.05 270 bottom
U$4  72.39,30.48 0 bottom
X1  24.13,55.88 180 top
X2  66.36,55.88 180 top
X3  108.58,55.88 180 top
X4  108.58,9.84 0 top
X5  66.36,9.84 0 top
X6  24.13,9.84 0 top
X7  134.62,48.26 90 top
Y1  112.39,40.96 315 top

### Tracks (layer width: path | path; a pad name or v marks a point on that pad's centre or on a via)
12V  (via drill 0.8)
  Top 1.016: F1.2 134.85,59.12 133.03,57.31 C9.1 130.7,55.4 D3.C 130.65,56.99 v130.81,57.15 | v127.32,50.48 126.21,49.37 104.78,49.37 100.49,45.09 D2.P$2
  Bottom 1.016: v130.81,57.15 130.81,53.98 v127.32,50.48
12VIN
  Top 1.016: IC4.P$3 83.46,36.47 88.9,41.91 91.44,41.91 93.34,43.82 C15.1 D2.P$1
AIN0  (1 unrouted)
  Bottom 0.406: R55.1 6.77,41.06 | 6.77,41.06 7.62,41.91 7.62,50.8 | 7.62,46.61 X1.P$13 | 6.77,41.06 10.79,37.04 IC8.P$16
AIN1
  Bottom 0.406: R54.1 9.63,41.06 | 9.63,41.06 10.48,41.91 10.48,51.23 X1.P$14 | 9.63,41.06 9.63,39.27 12.06,36.83 IC8.P$17
AIN2
  Bottom 0.406: R53.1 12.48,41.06 | 12.48,41.06 13.65,42.23 13.65,46.6 X1.P$15 | 12.48,41.06 12.48,37.68 13.34,36.83 IC8.P$18
AIN3
  Bottom 0.406: IC8.P$19 14.61,40.43 R52.1 15.66,41.06 16.51,41.91 16.51,51.26 X1.P$16
AIN4
  Bottom 0.406: IC8.P$20 15.88,38.84 R51.1 18.84,41.06 19.68,41.91 19.68,51.33 X1.P$17
AIN5
  Bottom 0.406: IC8.P$21 17.14,37.25 R50.1 21.38,41.06 22.54,42.23 22.54,51.29 X1.P$18
AIN6
  Bottom 0.406: IC8.P$22 18.41,36.83 22.64,41.06 R5.1 24.87,41.06 25.72,41.91 25.72,51.29 X1.P$19
AIN7
  Bottom 0.406: IC8.P$23 19.68,36.83 22.86,40.01 24.77,40.01 25.82,41.06 R10.1 27.73,41.06 28.57,41.91 28.57,51.33 X1.P$20
AIN8
  Bottom 0.305: R11.1 33.23,41.06 | 31.75,51.26 X1.P$21
  Bottom 0.406: R11.1 34.51,41.06 36.2,39.37 37.47,39.37 38.73,38.1 IC7.P$16 | 33.23,41.06 31.63,42.67 X1.P$21
AIN9
  Bottom 0.305: 34.92,51.09 X1.P$22
  Bottom 0.406: IC7.P$17 40.01,38.42 37.36,41.06 R12.1 35.24,42.33 35.24,50.64 34.63,51.25 X1.P$22
AIN10
  Bottom 0.406: IC7.P$18 41.27,40.01 40.22,41.06 R13.1 37.94,42.49 37.94,51.07 X1.P$23
AIN11
  Bottom 0.406: IC7.P$19 R14.1 40.96,42.65 40.96,51.05 X1.P$24
AIN12
  Bottom 0.406: X2.P$13 49.86,41.6 49.21,40.96 48.05,40.96 | 48.05,40.96 R15.1 | 48.05,40.96 46.67,40.96 43.81,38.1 IC7.P$20
AIN13
  Bottom 0.406: X2.P$14 52.86,41.43 52.39,40.96 51.54,40.96 | 51.54,40.96 R16.1 | 51.54,40.96 51.54,40.11 50.8,39.37 46.67,39.37 45.09,37.78 IC7.P$21
AIN14
  Bottom 0.406: X2.P$15 55.86,41.57 55.24,40.96 54.4,40.96 R17.1 54.29,39.37 53.02,38.42 47.94,38.42 46.35,36.83 IC7.P$22
AIN15
  Bottom 0.406: X2.P$16 58.86,41.4 58.42,40.96 57.57,40.96 R18.1 57.47,39.05 55.88,37.47 48.58,37.47 47.62,36.51 IC7.P$23
AIN16
  Bottom 0.406: X2.P$17 61.86,41.33 62.23,40.96 63.08,40.96 R19.1 64.83,39.42 66.88,39.42 69.22,37.08 U$4.P$16
AIN17
  Bottom 0.406: X2.P$18 64.86,41.51 65.41,40.96 65.94,40.96 R20.1 67.11,41.06 70.48,37.68 U$4.P$17
AIN18
  Bottom 0.406: 71.6,35.34 U$4.P$18 71.75,38.32 69.11,40.96 | X2.P$19 67.86,41.36 68.26,40.96 69.11,40.96 | 69.11,40.96 R4.1
AIN19
  Bottom 0.406: X2.P$20 70.86,41.22 71.12,40.96 71.97,40.96 | 71.97,40.96 R42.1 | 71.97,40.96 73.03,39.9 U$4.P$19
AIN20
  Bottom 0.406: X2.P$21 73.86,41.4 74.3,40.96 | 74.3,40.96 75.14,40.96 R43.1 | 74.3,40.96 U$4.P$20
AIN21
  Bottom 0.406: X2.P$22 76.86,41.57 77.47,40.96 78.32,40.96 R44.1 78.42,40.32 75.56,37.47 U$4.P$21
AIN22
  Bottom 0.406: X2.P$23 79.86,41.43 80.33,40.96 | 80.33,40.96 81.18,40.96 R45.1 | 80.33,40.96 80.33,38.49 79.38,37.54 77.5,37.54 76.83,36.88 U$4.P$22
AIN23
  Bottom 0.406: X2.P$24 82.86,41.6 83.5,40.96 84.67,40.96 R46.1 84.45,38.74 82.55,36.83 78.74,36.83 78.11,36.2 U$4.P$23
AIN24
  Bottom 0.406: X3.P$13 92.08,42.12 91.02,41.06 | 91.02,41.06 R49.1 | 91.02,41.06 92.08,40.01 IC5.P$16
AIN25
  Bottom 0.406: X3.P$14 95.08,42 94.14,41.06 R31.1 93.34,41.03 IC5.P$17
AIN26
  Bottom 0.406: X3.P$15 98.08,41.88 97.27,41.06 R32.1 94.61,38.82 IC5.P$18
AIN27
  Bottom 0.406: X3.P$16 101.08,41.75 100.39,41.06 R33.1 95.89,37.23 IC5.P$19
AIN28
  Bottom 0.406: X3.P$17 104.08,41.58 104.61,41.06 R34.1 106.74,39.73 109.69,39.73 111.25,38.17 112.5,38.17 113.67,37 IC6.P$16
AIN29
  Bottom 0.406: X3.P$18 107.08,41.71 107.73,41.06 R35.1 109.61,41.06 111.56,39.1 113.44,39.1 114.94,37.61 IC6.P$17
AIN30
  Bottom 0.406: X3.P$19 110.08,41.83 110.86,41.06 R36.1 112.46,40.04 113.75,40.04 116.2,37.59 IC6.P$18
AIN31
  Bottom 0.406: X3.P$20 113.08,41.96 113.98,41.06 R37.1 117.47,37.89 IC6.P$19
AIN32
  Bottom 0.406: X3.P$21 116.08,41.46 116.48,41.06 R38.1 118.75,39.79 IC6.P$20
AIN33
  Bottom 0.406: X3.P$22 119.08,41.58 119.61,41.06 R39.1 120.02,40.74 IC6.P$21
AIN34
  Bottom 0.406: X3.P$23 122.08,41.71 122.73,41.06 R40.1 123.19,38.23 121.28,36.33 IC6.P$22
AIN35
  Bottom 0.406: X3.P$24 125.08,41.83 125.86,41.06 R41.1 126.36,38.91 124.38,36.92 123.12,36.92 122.56,36.35 IC6.P$23
AIN36
  Bottom 0.406: IC6.P$2 122.56,23.71 R61.1 126.78,19.9 127.64,19.05 127.64,16.89 X4.P$13
AIN37
  Bottom 0.406: 122.24,14.49 X4.P$14 125.09,17.35 125.09,19.05 124.25,19.9 R60.1 123.09,19.9 121.28,21.7 IC6.P$3
AIN38
  Bottom 0.406: 119.06,14.37 X4.P$15 121.92,17.18 121.92,19.05 121.07,19.9 R59.1 119.91,19.9 119.91,25.68 IC6.P$4
AIN39
  Bottom 0.406: IC6.P$5 118.75,24.45 117.47,23.18 R58.1 117.89,19.9 118.75,19.05 118.75,17 X4.P$16
AIN40
  Bottom 0.406: IC6.P$6 117.47,24.77 114.3,21.59 R57.1 115.04,19.9 115.89,19.05 115.89,17.14 X4.P$17
AIN41
  Bottom 0.406: IC6.P$7 116.2,24.77 111.44,20 R56.1 111.86,19.9 112.71,19.05 112.71,16.97 X4.P$18
AIN42
  Bottom 0.406: IC6.P$8 114.94,24.77 111.12,20.95 109.22,20.95 108.58,20.32 R21.1 108.69,19.9 109.86,18.73 109.86,17.11 X4.P$19
AIN43
  Bottom 0.406: IC6.P$9 113.67,24.77 110.81,21.91 107,21.91 105.41,20.32 R22.1 105.83,19.9 107,18.73 107,17.25 X4.P$20
AIN44
  Bottom 0.406: X4.P$21 101.28,14.54 101.28,19.05 100.43,19.9 R23.1 95.89,23.71 IC5.P$6
AIN45
  Bottom 0.406: X4.P$22 98.11,14.37 98.11,19.37 97.58,19.9 R24.1 94.61,21.8 IC5.P$7
AIN46
  Bottom 0.406: X4.P$23 94.93,14.49 94.93,19.05 94.08,19.9 R25.1 IC5.P$8
AIN47
  Bottom 0.406: R26.1 91.22,19.9 | 91.22,19.9 92.08,19.05 92.08,14.35 X4.P$24 | 91.22,19.9 92.08,20.75 IC5.P$9
AIN48
  Bottom 0.406: R29.1 83.72,19.9 | 83.72,19.9 82.87,19.05 82.87,14.35 X5.P$13 | 83.72,19.9 82.03,21.59 81.28,21.59 78.11,24.77 U$4.P$2
AIN49
  Bottom 0.406: R30.1 80.86,19.9 | 80.86,19.9 80.01,19.05 80.01,14.49 X5.P$14 | 80.86,19.9 76.83,23.93 U$4.P$3
AIN50
  Bottom 0.406: R27.1 77.69,19.9 | 77.69,19.9 76.83,19.05 76.83,14.37 X5.P$15 | 77.69,19.9 75.56,22.02 U$4.P$4
AIN51
  Bottom 0.406: R28.1 74.83,19.9 | 74.83,19.9 73.98,19.05 73.98,14.46 X5.P$16 | 74.83,19.9 74.3,20.43 U$4.P$5
AIN52
  Bottom 0.406: X5.P$17 70.8,14.4 70.8,19.37 71.33,19.9 R47.1 72.07,22.54 73.03,23.5 U$4.P$6
AIN53
  Bottom 0.406: X5.P$18 67.94,14.43 67.94,19.05 68.8,19.9 R48.1 69.22,20.95 71.75,23.5 U$4.P$7
AIN54
  Bottom 0.406: X5.P$19 64.77,14.43 64.77,19.05 65.62,19.9 R62.1 66.36,20.64 66.67,20.95 67.94,20.95 70.48,23.5 U$4.P$8
AIN55
  Bottom 0.406: X5.P$20 61.91,14.4 61.91,19.37 62.45,19.9 R63.1 63.5,20.95 64.45,21.91 67.63,21.91 69.22,23.5 U$4.P$9
AIN56
  Bottom 0.406: 57.25,19.9 58.2,19.9 58.74,19.37 58.74,14.46 X5.P$21 | R64.1 57.25,19.9 | 57.25,19.9 54.29,22.86 49.21,22.86 47.62,24.45 IC7.P$2
AIN57
  Bottom 0.406: X5.P$22 55.88,14.37 55.88,19.37 55.35,19.9 R65.1 53.12,19.9 51.44,21.59 49.53,21.59 46.35,24.77 IC7.P$3
AIN58
  Bottom 0.406: X5.P$23 52.7,14.49 52.7,19.37 52.17,19.9 R66.1 50.27,19.9 48.58,21.59 46.67,21.59 45.09,23.18 IC7.P$4
AIN59
  Bottom 0.406: X5.P$24 49.85,14.35 49.85,19.37 49.31,19.9 R67.1 46.14,19.9 43.81,22.22 IC7.P$5
AIN60
  Bottom 0.406: IC7.P$6 42.55,20.54 R68.1 41.17,19.9 40.64,19.37 40.64,14.35 X6.P$13
AIN61
  Bottom 0.406: IC7.P$7 41.27,23.81 39.05,21.59 R69.1 38.31,19.9 37.78,19.37 37.78,14.49 X6.P$14
AIN62
  Bottom 0.406: 40.16,25.62 IC7.P$8 40.01,23.5 36.41,19.9 R70.1 35.14,19.9 34.61,19.37 34.61,14.37 X6.P$15
AIN63
  Bottom 0.406: IC7.P$9 38.73,23.5 36.83,21.59 34.29,21.59 33.27,20.57 R71.1 32.6,19.9 31.75,19.05 31.75,14.46 X6.P$16
AIN64
  Bottom 0.406: X6.P$17 28.57,14.4 28.57,19.05 27.73,19.9 R72.1 25.82,19.9 22.86,22.86 21.59,22.86 19.68,24.77 IC8.P$2
AIN65
  Bottom 0.406: X6.P$18 25.72,14.43 25.72,19.05 24.87,19.9 R73.1 22.96,19.9 18.41,24.45 IC8.P$3
AIN66
  Bottom 0.406: 22.63,14.52 X6.P$19 22.54,14.43 22.54,19.05 21.69,19.9 R74.1 17.14,24.03 IC8.P$4
AIN67
  Bottom 0.406: X6.P$20 19.68,14.4 19.68,19.05 18.84,19.9 R75.1 15.88,22.44 IC8.P$5
AIN68
  Bottom 0.406: X6.P$21 16.83,14.54 16.83,19.05 15.98,19.9 R76.1 14.61,20.54 IC8.P$6
AIN69
  Bottom 0.406: R77.1 12.8,19.9 | 12.8,19.9 13.65,19.05 13.65,14.37 X6.P$22 | 12.8,19.9 13.34,20.43 IC8.P$7
AIN70
  Bottom 0.406: 10.48,14.49 X6.P$23 10.79,14.51 10.79,19.05 9.95,19.9 | R78.1 9.95,19.9 | 9.95,19.9 9.95,22.01 12.06,24.13 IC8.P$8
AIN71
  Bottom 0.406: R79.1 6.77,19.9 | 6.77,19.9 7.62,19.05 7.62,14.35 X6.P$24 | 6.77,19.9 6.77,20.11 10.79,24.13 IC8.P$9
AREF
  Top 0.406: C10.2 97.06,21.63 IC1.62
AVCC
  Top 0.406: IC1.64 101.74,20 L1.2
AVR_SCK
  Top 0.406: IC1.11 108.87,26.67 120.97,26.67 122.24,25.4 ISP1.SCK
CAN_H
  Top 0.305: IC2.7 130.98,41.28 IC3.2
  Top 0.406: IC3.2 131.76,45.55 X7.P$4
CAN_L
  Top 0.305: IC2.6 130.81,40.01 131.76,40.96 132.56,40.96 IC3.1
  Top 0.406: X7.P$2 136.01,46.16 133.67,43.82 IC3.1
GND  (via drill 0.6)
  Top 0.406: IC4.P$1 67.55,33.26 67.31,33.02
  other vias: 2.54,17.78 2.54,15.24 2.54,12.7 2.54,10.16 2.54,7.62 2.54,5.08 2.54,2.54 5.08,2.54 7.62,2.54 10.16,2.54 12.7,2.54 15.24,2.54 17.78,2.54 20.32,2.54 22.86,2.54 25.4,2.54 27.94,2.54 30.48,2.54 33.02,2.54 35.56,2.54 38.1,2.54 40.64,2.54 43.18,2.54 45.72,2.54 48.26,2.54 50.8,2.54 53.34,2.54 55.88,2.54 58.42,2.54 147.32,20.32 147.32,17.78 147.32,15.24 147.32,12.7 147.32,10.16 147.32,7.62 147.32,5.08 147.32,2.54 45.72,60.96 48.26,60.96 55.88,60.96 58.42,60.96 60.96,60.96 63.5,60.96 66.04,60.96 68.58,60.96 71.12,60.96 73.66,60.96 76.2,60.96 83.82,60.96 86.36,60.96 88.9,60.96 91.44,60.96 96.52,60.96 147.32,55.88 2.54,55.88 5.08,60.96 7.62,60.96 12.7,60.96 15.24,60.96 17.78,60.96 20.32,60.96 22.86,60.96 25.4,60.96 27.94,60.96 30.48,60.96 33.02,60.96 35.56,60.96 40.64,60.96 43.18,60.96 60.96,2.54 63.5,2.54 66.04,2.54 68.58,2.54 71.12,2.54 73.66,2.54 76.2,2.54 78.74,2.54 81.28,2.54 83.82,2.54 86.36,2.54 88.9,2.54 91.44,2.54 93.98,2.54 99.06,2.54 96.52,2.54 99.06,60.96 101.6,60.96 104.14,60.96 106.68,60.96 109.22,60.96 111.76,60.96 114.3,60.96 116.84,60.96 119.38,60.96 127,60.96 129.54,60.96 132.08,60.96 134.62,60.96 101.6,2.54 104.14,2.54 106.68,2.54 109.22,2.54 111.76,2.54 114.3,2.54 116.84,2.54 119.38,2.54 121.92,2.54 124.46,2.54 127,2.54 129.54,2.54 132.08,2.54 134.62,2.54 147.32,53.34 147.32,50.8 147.32,48.26 147.32,45.72 147.32,43.18 147.32,40.64 147.32,38.1 147.32,35.56 147.32,33.02 147.32,30.48 147.32,27.94 147.32,25.4 147.32,22.86 2.54,53.34 2.54,50.8 2.54,48.26 2.54,45.72 2.54,43.18 2.54,40.64 2.54,38.1 2.54,35.56 2.54,30.48 2.54,27.94 137.16,60.96 139.7,60.96 142.24,60.96 137.16,2.54 139.7,2.54 142.24,2.54 144.78,2.54 2.54,33.02 2.54,58.42 2.54,60.96 147.32,60.96 113.03,29.21
  pour Top (isolate 0.305, rank 6): 0,0 150.16,0 150.16,63.5 0,63.5
  pour Bottom (isolate 0.305, rank 6): 0,0 150.16,0 150.16,63.5 0,63.5
N$6
  Top 0.406: R3.1 128.49,44.24 IC2.8
N$9
  Top 0.406: R6.1 D4.A
OUT0  (via drill 0.6)
  Top 0.406: v86.36,19.68 88.33,19.68 IC1.56
  Bottom 0.406: U$4.P$1 80.27,25.78 v86.36,19.68
OUT1  (via drill 0.6)
  Top 0.406: v103.82,17.78 102.55,16.51 95.57,16.51 92.71,19.37 92.71,21.8 IC1.58
  Bottom 0.406: IC5.P$1 103.82,24.19 v103.82,17.78
OUT2  (via drill 0.6)
  Top 0.406: IC1.57 95.76,25.91 91.76,21.91 91.76,19.37 95.25,15.88 128.91,15.88 v130.81,17.78
  Bottom 0.406: IC6.P$1 123.83,24.77 v130.81,17.78
OUT3  (via drill 0.6)
  Top 0.406: v60.33,19.68 84.77,19.68 85.72,20.64 88.16,20.64 IC1.55
  Bottom 0.406: IC7.P$1 54.23,25.78 v60.33,19.68
OUT4  (via drill 0.6)
  Top 0.406: v29.84,19.68 58.42,19.68 59.69,20.95 84.45,20.95 85.41,21.91 88.29,21.91 IC1.54
  Bottom 0.406: IC8.P$1 23.75,25.78 v29.84,19.68
RESET  (via drill 0.6)
  Top 0.406: C16.1 137.16,32.2 JP1.2 137.03,29.02 R1.1 136.26,29.79 D1.A 132.13,29.79 v132.08,29.84 | IC1.20 109.87,35.56 110.49,35.56 115.57,30.48 120.65,30.48 123.19,27.94 ISP1.RESET 125.28,29.84 v125.41,29.84
  Bottom 0.406: v125.41,29.84 v132.08,29.84
RX
  Top 0.406: IC1.2 103.77,21.59 110.49,21.59 113.03,24.13 120.65,24.13 121.92,22.86 ISP1.MISO
RXCAN
  Top 0.406: IC2.4 123.83,38.74 124.46,39.37 124.46,42.86 119.06,48.26 105.41,48.26 103.5,46.36 103.5,41.59 102.83,40.91 IC1.31
S0  (via drill 0.6)
  Top 0.406: IC1.35 97.66,41.28 94.93,41.28 89.22,35.56 84.45,35.56 82.87,33.97 v82.87,25.4
  Bottom 0.406: IC6.P$10 112.39,24.77 110.49,22.86 109.22,22.86 104.78,27.3 91.12,27.3 90.81,26.99 IC5.P$10 90.81,24.77 89.22,23.18 87.63,23.18 83.5,27.3 81.06,27.3 | IC8.P$10 9.53,26.67 10.16,27.3 23.81,27.3 27.62,23.5 36.83,23.5 37.47,24.13 IC7.P$10 37.47,26.99 37.78,27.3 53.98,27.3 58.42,22.86 67.31,22.86 67.94,23.5 U$4.P$10 67.94,26.99 68.26,27.3 81.06,27.3 | 81.06,27.3 81.06,27.2 v82.87,25.4
S1  (via drill 0.6)
  Top 0.406: IC1.36 97.17,40.64 95.25,40.64 89.53,34.93 85.09,34.93 83.82,33.66 83.82,29.84 v85.72,27.94
  Bottom 0.406: IC6.P$11 111.12,24.77 110.49,24.13 109.22,24.13 105.41,27.94 90.49,27.94 89.53,26.99 IC5.P$11 89.53,24.77 88.9,24.13 87.63,24.13 85.09,26.67 | 85.09,26.67 83.82,27.94 67.63,27.94 66.67,26.99 U$4.P$11 66.67,24.45 65.72,23.5 59.05,23.5 54.61,27.94 37.47,27.94 36.2,26.67 IC7.P$11 36.2,24.77 35.56,24.13 27.94,24.13 24.13,27.94 8.89,27.94 8.26,27.3 IC8.P$11 | 85.09,26.67 85.09,27.3 v85.72,27.94
S2  (via drill 0.6)
  Top 0.406: v85.41,33.66 89.22,33.66 95.57,40.01 96.67,40.01 IC1.37
  Bottom 0.406: IC8.P$14 8.26,32.38 8.89,31.75 30.48,31.75 33.02,34.29 33.02,35.56 34.29,36.83 35.56,36.83 36.2,36.2 IC7.P$14 36.2,33.66 38.1,31.75 62.23,31.75 63.5,33.02 63.5,35.56 64.77,36.83 66.04,36.83 66.67,36.2 U$4.P$14 66.67,33.66 68.58,31.75 85.41,31.75 87,33.34 | 87,33.34 87,35.88 87.95,36.83 88.9,36.83 89.53,36.2 IC5.P$14 89.53,33.66 91.44,31.75 106.68,31.75 108.58,33.66 108.58,36.2 109.22,36.83 110.49,36.83 111.12,36.2 IC6.P$14 | 87,33.34 86.68,33.66 v85.41,33.66
S3  (via drill 0.6)
  Top 0.406: v88.27,31.43 88.27,31.75 95.73,39.21 96.33,39.21 IC1.38
  Bottom 0.406: 65.41,32.7 U$4.P$13 | 65.41,32.7 66.67,32.7 68.26,31.11 86.36,31.11 | IC6.P$13 109.86,33.02 107.95,31.11 90.81,31.11 88.9,33.02 88.27,33.02 | 86.36,31.11 88.27,33.02 | 88.27,33.02 IC5.P$13 | 65.41,32.7 63.82,31.11 37.78,31.11 34.92,33.97 | IC8.P$13 6.99,32.7 8.57,31.11 33.66,31.11 34.92,32.38 34.92,33.97 | IC7.P$13 34.92,33.97 | 86.36,31.11 87.95,31.11 v88.27,31.43
TX
  Top 0.406: IC1.3 103.95,22.54 109.86,22.54 112.71,25.4 ISP1.MOSI
TXCAN
  Top 0.406: IC2.1 122.4,42.6 122.4,43.97 118.75,47.62 106.05,47.62 104.14,45.72 104.14,41.15 IC1.30
UF_12V
  Top 1.016: X7.P$1 136.87,55.78 F1.1
VCC  (via drill 0.6, 0.8)
  Top 0.406: 132.77,26.09 D1.C 136.26,26.09 R1.2 139.38,26.99 140.97,28.57 v140.97,35.56 | ISP1.VCC 117.07,22.01 L1.1 126.68,20 v129.54,22.86 132.77,26.09 | v24.13,36.83 24.13,54.61 | v55.88,35.56 55.88,39.05 59.37,42.55 C3.1 61.55,42.27 IC4.P$4 69.85,45.08 R6.2 | IC2.3 121.28,40.01 120.65,39.37 120.65,36.83 121.92,35.56 125.73,35.56 v127,36.83 | v84.45,24.13 87.95,27.62 91.75,27.62 IC1.52 92.94,28.81 98.42,34.29 106.68,34.29 | 106.68,34.29 107.47,34.29 IC1.21 109.37,36.2 111.12,36.2 115.89,31.43 125.73,31.43 131.07,26.09 132.77,26.09 | v104.14,36.83 106.68,34.29
  Top 1.016: 125.17,11.43 X4.P$1 | 69.85,36.83 IC4.P$2 69.85,34.93 80.96,23.81 84.14,23.81 v84.45,24.13 | v86.36,44.45 84.18,42.27 IC4.P$4 | v86.36,50.8 86.36,54.61 85.09,55.88 | v87.95,17.78 87.95,10.16
  Bottom 0.406: IC8.P$24 24.07,35.18 C8.1 v24.13,36.83 | U$4.P$24 82.49,35.18 C4.1 82.55,35.56 86.36,39.37 v86.36,44.45 | IC5.P$24 105.35,35.18 C5.1 104.14,36.51 v104.14,36.83 | 125.73,10.16 127.95,10.16 132.72,14.92 132.72,19.68 v129.54,22.86 | IC6.P$24 123.89,35.24 C6.1 | IC7.P$24 52.01,35.18 C7.1 55.56,35.24 v55.88,35.56 | C6.1 127.32,35.56 v140.97,35.56 | v127,36.83 C6.1
  Bottom 1.016: v86.36,44.45 v86.36,50.8 | v84.45,24.13 87.95,20.64 v87.95,17.78
  pour Top (isolate 0.305): 64.77,44.45 78.74,44.45 78.74,34.29 64.77,34.29
  pour Bottom: 5.08,56.83 127,56.83 127,54.29 5.08,54.29
  pour Top: 5.08,56.83 127,56.83 127,54.29 5.08,54.29
  pour Top: 6.35,11.43 127,11.43 127,8.89 6.35,8.89
  pour Bottom: 6.35,11.43 127,11.43 127,8.89 6.35,8.89
XTAL1
  Top 0.406: C1.2 110.37,45.76 Y1.1 108.98,39.2 IC1.24
XTAL2
  Top 0.406: C2.2 117.35,39.09 Y1.2 114.78,38.58 109.54,38.58 107.35,36.39 IC1.23

### Text on the board
tPlace: 0 1 2 3 4 5 6 7 8 9 10 11 | 12 13 14 15 16 17 18 19 20 21 22 23 | 24 25 26 27 28 29 30 31 32 33 34 35 | 71 70 69 68 67 66 65 64 63 62 61 60 | 59 58 57 56 55 54 53 52 51 50 49 48 | 47 46 45 44 43 42 41 40 39 38 37 36